# EasyEDA Pro project ProProject_高通AI开发板9.7.epro, board PCB3
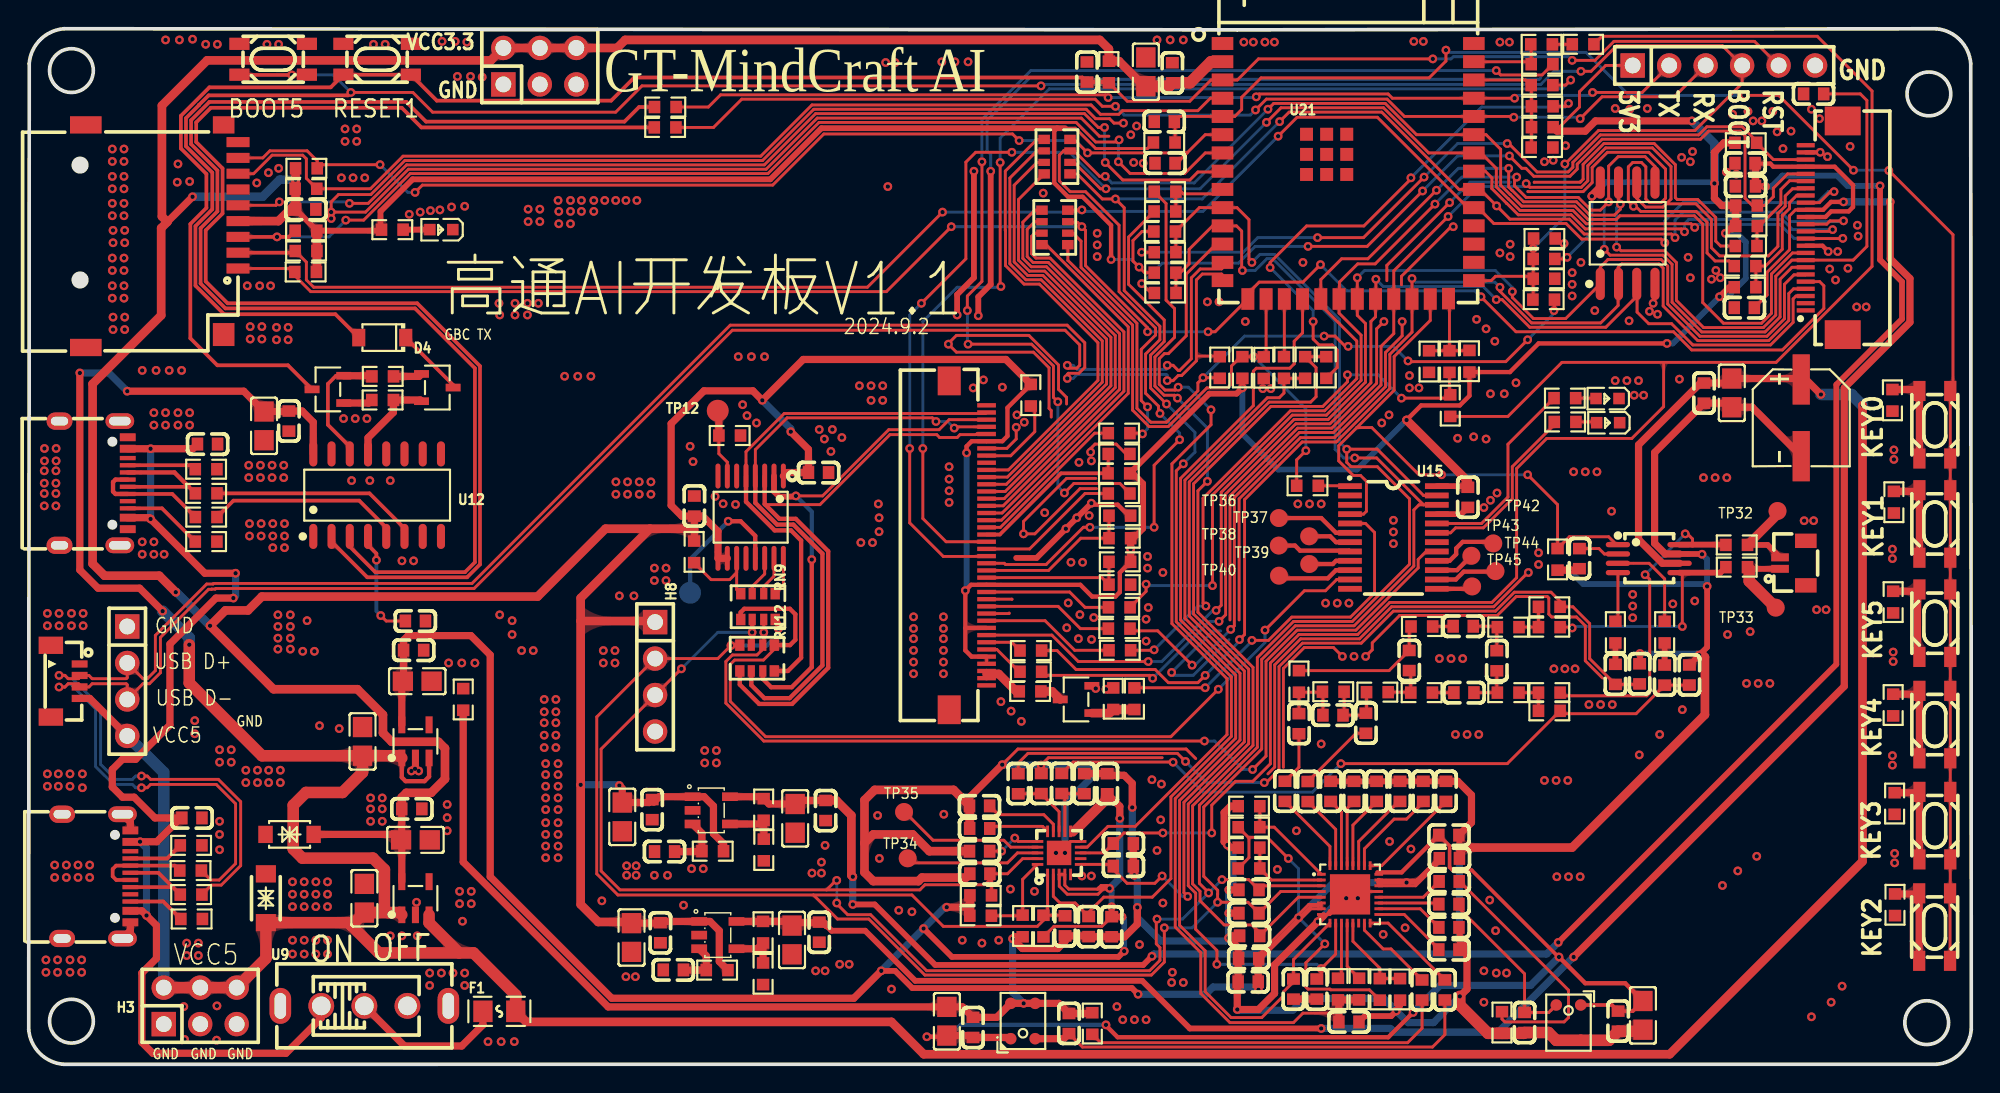
[diagram p5: board, top side]
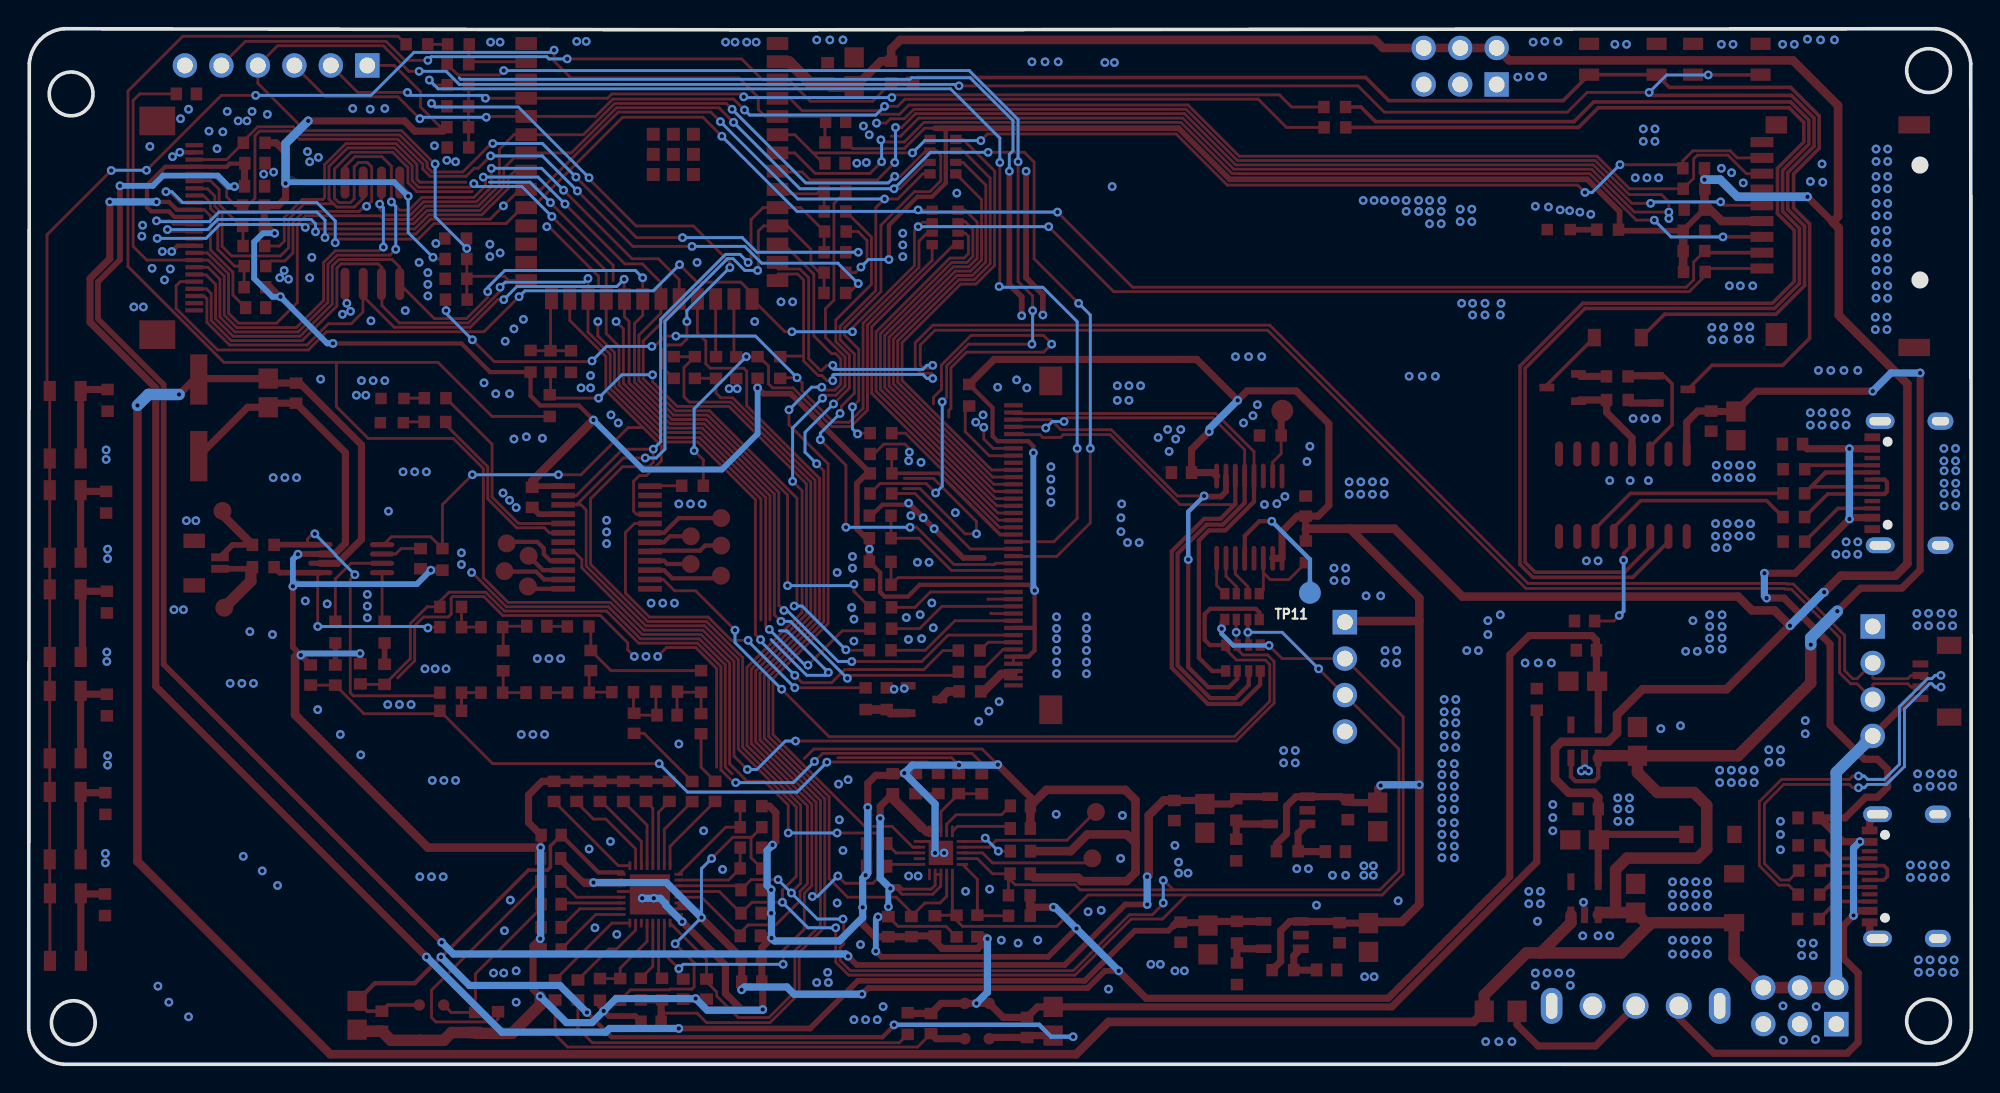
[diagram p6: board, bottom side, seen from below]

Outline 135.26 x 72.11 mm; copper layers: Top Layer, Bottom Layer. Coordinates in mm from the lower left corner of the outline.
Outline path: circle c2.98,69.19 r1.52 ; circle c2.98,3 r1.52 ; circle c132.16,2.9 r1.52 ; circle c132.31,67.57 r1.52 ; 0.04,69.69 0,2.42 arc(0.76,0.77) 2.42,0 132.84,0 arc(134.5,0.77) 135.26,2.42 135.22,69.69 arc(134.47,71.33) 132.83,72.1 84.15,72.03 2.45,72.11 arc(0.8,71.34) 0.04,69.69
Stack: Top Layer 0.035mm - / Dielectric1 1.51mm FR4 er 4.5 / Bottom Layer 0.035mm -

## Design rules (mm)
net ESP_USB_DP: DP1
net ESP_USB_DM: DP1
template: 自定义配置
spacing copperThickness1oz (default): track to track 0.102, other pairs 0.152 to 0.3
spacing copperThickness2oz: track to track 0.203, other pairs 0.152 to 0.3
track width copperThickness1oz (default): min 0.127, default 0.254, max 2.54
track width copperThickness2oz: min 0.203, default 0.254, max 2.54
differential pair differentialPair (default): width min 0.127, default 0.254, max 2.54; gap min 0.152, default 0.152
via viaSize (default): diameter min 0.5, default 0.61, max 10; hole min 0.3, default 0.305, max 6.3

## Placement (name value [footprint] x y rotation side)
BOOT5  TS-1145A-B-A  [SW-SMD_4P-L4.2-W3.2-P2.15-LS5.2]  17.02 69.98 270 top
C1  100nF  [C0603]  73.69 69.09 90 top
C4  100nF  [C0603]  19.29 59.53 180 top
C10  10uF  [C0805]  23.37 11.56 270 top
C11  10uF  [C0805]  26.93 15.62 180 top
C12  100nF  [C0603]  26.67 17.78 180 top
C13  10uF  [C0805]  23.24 22.48 270 top
C14  10uF  [C0805]  27.05 26.67 180 top
C15  100nF  [C0603]  26.8 28.83 180 top
C16  100nF  [C0603]  11.36 17.15 180 top
C34  470nF  [C0603]  99.93 25.88 180 top
C35  100nF  [C0603]  26.93 30.86 0 top
C36  10uF  [C0805]  16.39 44.45 270 top
C37  100nF  [C0603]  18.12 44.78 270 top
C38  100nF  [C0603]  12.45 43.18 180 top
C39  470nF  [C0603]  99.88 30.5 180 top
C40  220nF  [C0603]  88.45 23.72 270 top
C41  100nF  [C0603]  100.21 39.48 270 top
C69  100nF  [C0603]  54.99 41.2 180 top
C70  100nF  [C0603]  46.35 38.87 270 top
C73  22uF  [C0805]  77.79 69.11 90 top
C74  100nF  [C0603]  79.63 69.04 90 top
C75  100nF  [C0603]  79.12 62.74 0 top
C76  100nF  [C0603]  79.07 65.64 0 top
C78  10uF  [C0805]  41.33 17.22 90 top
C79  100nF  [C0603]  43.41 17.73 90 top
C80  100nF  [C0603]  44.28 14.81 0 top
C81  10uF  [C0805]  53.37 17.12 90 top
C82  100nF  [C0603]  55.49 17.67 90 top
C83  10uF  [C0805]  41.97 8.83 90 top
C84  100nF  [C0603]  43.98 9.16 90 top
C85  100nF  [C0603]  44.89 6.57 0 top
C86  10uF  [C0805]  53.15 8.66 90 top
C87  100nF  [C0603]  55.05 9.2 90 top
C88  100nF  [C0603]  119.51 62.74 180 top
C89  100nF  [C0603]  119.46 52.68 180 top
C90  100nF  [C0603]  119.54 61.14 180 top
C91  22pF/NC  [C0603]  124.28 67.57 0 top
C92  22pF  [C0603]  73.8 9.59 90 top
C93  22pF  [C0603]  72.16 9.64 90 top
C94  100nF  [C0603]  75.41 9.58 90 top
C95  22pF  [C0603]  76.22 13.8 180 top
C96  22pF  [C0603]  76.22 15.37 180 top
C97  1uF  [C0603]  75.1 19.54 270 top
C98  1uF  [C0603]  68.9 19.54 270 top
C99  1uF  [C0603]  71.93 19.55 270 top
C100  22pF  [C0603]  70.51 19.55 270 top
C101  22pF  [C0603]  73.5 19.54 270 top
C102  1uF  [C0603]  66.21 17.99 0 top
C103  1uF  [C0603]  66.22 16.42 0 top
C104  1uF  [C0603]  66.21 14.84 0 top
C105  22pF  [C0603]  66.23 13.27 0 top
C106  1uF  [C0603]  84.94 7.37 180 top
C107  100nF  [C0603]  84.91 5.74 0 top
C108  22pF  [C0603]  84.97 12.14 0 top
C109  22pF  [C0603]  84.97 10.52 0 top
C110  22pF  [C0603]  85.02 8.94 0 top
C111  22pF  [C0603]  88.06 5.24 90 top
C112  22pF  [C0603]  89.69 5.24 90 top
C113  22pF  [C0603]  91.93 2.95 180 top
C114  1uF  [C0603]  97.02 5.17 270 top
C115  1uF  [C0603]  98.61 5.18 270 top
C116  1uF  [C0603]  98.89 9.53 180 top
C117  1uF  [C0603]  98.89 7.98 180 top
C118  1uF  [C0603]  98.91 12.73 180 top
C119  1uF  [C0603]  98.89 11.15 180 top
C120  1uF  [C0603]  98.92 14.33 180 top
C121  1uF  [C0603]  98.89 15.95 180 top
C122  1uF  [C0603]  98.68 19 270 top
C123  1uF  [C0603]  97.11 19 270 top
C124  1uF  [C0603]  95.48 19 270 top
C125  1uF  [C0603]  93.86 19 270 top
C126  1uF  [C0603]  92.28 19 270 top
C127  1uF  [C0603]  90.66 19 270 top
C128  1uF  [C0603]  89.07 18.99 270 top
C129  1uF  [C0603]  87.47 19 270 top
C130  1uF  [C0603]  107.98 35.21 270 top
C131  1uF  [C0603]  116.65 46.73 270 top
C132  10uF  [C0805]  118.59 46.75 90 top
C133  220uF  [CAP-SMD_BD6.3-L6.6-W6.6-FD]  123.42 45.01 270 top
C134  1uF  [C0603]  65.75 2.57 90 top
C135  10uF  [C0805]  63.93 3 270 top
C136  22pF  [C0603]  72.43 2.84 270 top
C137  1uF  [C0603]  110.67 3 270 top
C138  10uF  [C0805]  112.4 3.41 90 top
C139  22pF  [C0603]  104.16 2.91 90 top
C140  22pF  [C0603]  115.63 27.11 270 top
C141  100nF  [C0603]  113.91 27.1 270 top
C142  22pF  [C0603]  112.17 27.19 270 top
C143  100nF  [C0603]  110.48 27.15 270 top
C144  220nF  [C0603]  93.11 23.75 270 top
C145  10nF  [C0603]  102.23 28.1 270 top
C146  2.2nF  [C0603]  96.12 28.11 270 top
C147  100pF  [C0603]  90.82 24.31 0 top
CARD1  TF PUSH  [TF-SMD_TF-PUSH]  9.27 57.66 270 top
CN5  0.8-2AB  [CONN-SMD_2P-P0.80_HCTL_HC-0.8-2PWT]  122.84 34.9 90 top
CN6  M0800RS-04-GN  [CONN-SMD_M0800RS-04-GN]  2.54 26.67 270 top
D2  SMFJ5.0CA  [SOD-123FL_L2.8-W1.8-LS3.7-BI]  16.51 11.56 270 top
D3  SMFJ3.3CA  [SOD-123_L2.7-W1.6-LS3.7-BI]  18.16 16.01 0 top
D4  1N5819HW-7-F  [SOD-123_L2.7-W1.6-LS3.7-RD]  24.62 50.6 180 top
F1  BSMD0805-100-6V  [F0805]  32.77 3.69 0 top
FPC5  AFC01-S40FCA-00  [FPC-SMD_P0.50-40P_FGS-XJ-H2.0]  65.4 36.14 90 top
FPC6  FPC-05F-24PH20  [FPC-SMD_24P-P0.50_FPC-05F-24PH20]  125.02 58.25 90 top
H2  PZ254V-12-6P  [HDR-TH_6P-P2.54-V-M-R2-C3-S2.54]  35.59 69.5 0 top
H3  PZ254V-12-6P  [HDR-TH_6P-P2.54-V-M-R2-C3-S2.54]  11.94 4.07 0 top
H5  PZ254V-11-04P  [HDR-TH_4P-P2.54-V-M]  6.86 26.67 270 top
H7  PZ254V-11-06P  [HDR-TH_6P-P2.54-V-M]  118.04 69.55 0 top
H8  PZ254V-11-04P  [HDR-TH_4P-P2.54-V-M]  43.62 26.98 270 top
KEY0  TS-1145A-B-A  [SW-SMD_4P-L4.2-W3.2-P2.15-LS5.2]  132.72 44.53 180 top
KEY1  TS-1145A-B-A  [SW-SMD_4P-L4.2-W3.2-P2.15-LS5.2]  132.72 37.62 180 top
KEY2  TS-1145A-B-A  [SW-SMD_4P-L4.2-W3.2-P2.15-LS5.2]  132.71 9.55 180 top
KEY3  TS-1145A-B-A  [SW-SMD_4P-L4.2-W3.2-P2.15-LS5.2]  132.72 16.62 180 top
KEY4  TS-1145A-B-A  [SW-SMD_4P-L4.2-W3.2-P2.15-LS5.2]  132.72 23.65 180 top
KEY5  TS-1145A-B-A  [SW-SMD_4P-L4.2-W3.2-P2.15-LS5.2]  132.72 30.71 180 top
LED2  KT-0603R  [LED0603-RD]  28.73 58.12 180 top
LED3  KT-0603R  [LED0603-RD]  109.98 44.67 180 top
LED4  KT-0603R  [LED0603-RD]  109.93 46.36 180 top
Q2  S8050 J3Y  [SOT-23-3_L3.0-W1.7-P0.95-LS2.9-BR]  28.45 47.12 180 top
Q3  S8050 J3Y  [SOT-23-3_L3.0-W1.7-P0.95-LS2.9-BR]  20.83 46.99 0 top
Q4  S8050 J3Y  [SOT-23-3_L3.0-W1.7-P0.95-LS2.9-BR]  72.93 25.4 0 top
R1  10kΩ  [R0603]  75.21 69.09 90 top
R3  510Ω  [R0603]  25.32 58.11 0 top
R7  47kΩ  [R0603]  19.31 56.63 180 top
R8  47kΩ  [R0603]  19.31 58.04 180 top
R9  47kΩ  [R0603]  19.31 60.96 0 top
R11  10kΩ/NC  [R0603]  48.81 43.78 0 top
R13  100kΩ/NC  [R0603]  46.33 35.68 270 top
R26  10kΩ  [R0603]  24.65 47.9 0 top
R27  10kΩ  [R0603]  24.64 46.25 180 top
R28  4.7kΩ  [R0603]  12.35 41.43 180 top
R29  4.7kΩ  [R0603]  12.35 36.39 180 top
R30  22Ω  [R0603]  12.36 39.75 180 top
R31  22Ω  [R0603]  12.36 38.1 180 top
R41  4.7kΩ  [R0603]  11.31 15.24 180 top
R42  4.7kΩ  [R0603]  11.34 10.12 180 top
R43  22Ω  [R0603]  11.27 13.49 180 top
R44  22Ω  [R0603]  11.31 11.81 180 top
R53  33Ω  [R0603]  75.93 39.74 180 top
R54  33Ω  [R0603]  75.92 43.95 180 top
R55  33Ω  [R0603]  75.93 30.33 180 top
R56  33Ω  [R0603]  75.94 31.82 180 top
R57  33Ω  [R0603]  69.78 28.81 180 top
R58  33Ω  [R0603]  75.97 28.83 180 top
R60  33Ω  [R0603]  69.78 27.33 180 top
R61  0Ω  [R0603]  75.91 41.14 180 top
R62  0Ω/NC  [R0603]  75.92 42.5 180 top
R63  1Ω  [R0603]  69.73 25.96 180 top
R64  0Ω  [R0603]  69.78 46.59 270 top
R65  0Ω  [R0603]  75.97 38.2 0 top
R66  0Ω/NC  [R0603]  75.97 36.63 0 top
R67  0Ω/NC  [R0603]  75.97 34.99 0 top
R68  0Ω  [R0603]  75.97 33.39 0 top
R69  1kΩ  [R0603]  76.99 25.45 270 top
R70  4.7kΩ  [R0603]  75.52 25.45 270 top
R73  0Ω  [R0603]  89.04 40.28 0 top
R77  47kΩ  [R0603]  19.28 55.17 180 top
R78  47kΩ  [R0603]  19.33 62.39 0 top
R80  0Ω  [R0603]  79.12 59.38 0 top
R81  0Ω  [R0603]  88.88 48.52 270 top
R82  0Ω  [R0603]  98.98 45.86 90 top
R83  0Ω  [R0603]  79.12 60.76 0 top
R84  0Ω  [R0603]  87.4 48.52 90 top
R85  0Ω  [R0603]  98.93 48.93 90 top
R87  0Ω  [R0603]  90.35 48.52 270 top
R88  0Ω  [R0603]  108.23 71.02 180 top
R89  0Ω  [R0603]  79.12 56.54 0 top
R90  0Ω  [R0603]  79.13 53.71 0 top
R91  0Ω/NC  [R0603]  82.93 48.52 90 top
R93  0Ω/NC  [R0603]  105.39 66.7 180 top
R94  0Ω  [R0603]  105.37 68.18 180 top
R95  0Ω/NC  [R0603]  105.34 71.02 180 top
R96  0Ω  [R0603]  105.37 69.64 180 top
R97  10kΩ/NC  [R0603]  84.51 48.52 270 top
R98  10kΩ  [R0603]  79.07 64.18 180 top
R99  10kΩ/NC  [R0603]  100.32 48.95 270 top
R100  10kΩ/NC  [R0603]  105.39 65.25 0 top
R101  10kΩ/NC  [R0603]  105.51 56.08 0 top
R102  10kΩ/NC  [R0603]  86 48.5 90 top
R103  10kΩ/NC  [R0603]  97.5 48.93 90 top
R104  10kΩ/NC  [R0603]  105.37 63.84 180 top
R105  10kΩ/NC  [R0603]  105.54 57.5 180 top
R106  0Ω/NC  [R0603]  105.49 53.24 180 top
R107  0Ω  [R0603]  105.51 54.7 180 top
R108  3.3kΩ  [R0603]  79.1 57.99 180 top
R109  3.3kΩ  [R0603]  79.12 55.12 180 top
R115  10kΩ  [R0603]  47.63 14.84 0 top
R116  150kΩ  [R0603]  51.18 17.74 90 top
R117  120kΩ  [R0603]  51.18 14.92 90 top
R118  10kΩ  [R0603]  47.93 6.56 0 top
R120  120kΩ  [R0603]  51.13 6.3 90 top
R121  24kΩ  [R0603]  51.13 9.2 90 top
R122  10kΩ/NC  [R0603]  119.56 64.16 180 top
R123  10kΩ/NC  [R0603]  119.61 59.8 180 top
R124  10kΩ/NC  [R0603]  119.51 54.11 180 top
R125  10kΩ  [R0603]  119.61 58.37 180 top
R126  10kΩ/NC  [R0603]  119.59 56.98 0 top
R127  10kΩ  [R0603]  119.51 55.58 0 top
R129  5.1kΩ  [R0603]  106.98 44.73 0 top
R132  5.1kΩ  [R0603]  106.96 46.38 0 top
R134  2kΩ/NC  [R0603]  70.66 9.62 270 top
R135  2kΩ/NC  [R0603]  66.29 11.76 180 top
R136  10kΩ  [R0603]  69.21 9.63 270 top
R137  10kΩ/NC  [R0603]  66.28 10.34 0 top
R138  10kΩ/NC  [R0603]  84.97 16.51 0 top
R139  10kΩ  [R0603]  84.97 17.97 0 top
R140  10kΩ/NC  [R0603]  84.97 13.64 0 top
R141  10kΩ  [R0603]  84.97 15.09 0 top
R142  51Ω  [R0603]  91.16 5.24 90 top
R143  0Ω/NC  [R0603]  92.64 5.24 90 top
R144  10kΩ/NC  [R0603]  94.08 5.21 90 top
R145  10kΩ/NC  [R0603]  95.49 5.21 90 top
R146  10kΩ  [R0603]  106.45 35.16 90 top
R147  0Ω  [R0603]  74.06 2.84 270 top
R148  0Ω  [R0603]  102.59 2.91 90 top
R149  0Ω  [R0603]  118.93 36.16 0 top
R150  0Ω  [R0603]  118.93 34.62 0 top
R151  150kΩ  [R0603]  113.91 30.09 90 top
R152  150kΩ  [R0603]  110.48 30.09 90 top
R153  2.2kΩ  [R0603]  103.02 25.88 180 top
R154  2.2kΩ  [R0603]  103.02 30.44 180 top
R155  20kΩ  [R0603]  93.91 25.91 180 top
R156  20kΩ  [R0603]  88.45 26.66 270 top
R157  10kΩ  [R0603]  96.99 25.88 0 top
R158  10kΩ  [R0603]  97.01 30.48 0 top
R159  4.3kΩ  [R0603]  90.84 25.94 0 top
R160  0Ω  [R0603]  105.88 24.61 180 top
R161  0Ω  [R0603]  105.88 31.85 180 top
R162  0Ω/NC  [R0603]  105.88 25.88 180 top
R163  0Ω/NC  [R0603]  105.88 30.44 180 top
R164  27kΩ  [R0603]  129.77 46.23 90 top
R165  10kΩ  [R0603]  129.95 11.11 90 top
R166  15kΩ  [R0603]  129.87 39.14 90 top
R167  5.1kΩ  [R0603]  129.92 18.16 90 top
R168  3.3kΩ  [R0603]  129.82 25.01 90 top
R169  1.3kΩ  [R0603]  129.82 32.18 90 top
R170  0Ω  [R0603]  30.25 25.4 90 top
R171  0Ω  [R0603]  44.31 65.23 0 top
R172  0Ω  [R0603]  44.33 66.65 0 top
RESET1  TS-1145A-B-A  [SW-SMD_4P-L4.2-W3.2-P2.15-LS5.2]  24.26 69.98 270 top
RN9  33Ω  [RES-ARRAY-SMD_0603-8P-L3.2-W1.6-BL]  50.78 31.87 180 top
RN10  33Ω  [RES-ARRAY-SMD_0603-8P-L3.2-W1.6-BL]  71.61 63.2 90 top
RN11  33Ω  [RES-ARRAY-SMD_0603-8P-L3.2-W1.6-BL]  71.45 58.27 90 top
RN12  33Ω  [RES-ARRAY-SMD_0603-8P-L3.2-W1.6-BL]  50.71 28.29 180 top
TP11  -  [TP]  46.05 32.83 180 bottom
TP12  -  [TP]  47.98 45.51 180 top
TP32  -  [测试点]  121.77 38.53 270 top
TP33  -  [测试点]  121.64 31.8 270 top
TP34  -  [测试点]  61.2 14.34 0 top
TP35  -  [测试点]  60.95 17.57 0 top
TP36  -  [测试点]  87.05 38.03 270 top
TP37  -  [测试点]  89.16 36.76 270 top
TP38  -  [测试点]  87.04 36.12 270 top
TP39  -  [测试点]  89.16 34.83 270 top
TP40  -  [测试点]  87.06 34.02 270 top
TP42  -  [测试点]  101.98 36.27 180 top
TP43  -  [测试点]  100.46 35.41 90 top
TP44  -  [测试点]  102.13 34.34 90 top
TP45  -  [测试点]  100.51 33.27 90 top
U7  RT9013-33GB  [SOT-23-5_L3.0-W1.7-P0.95-LS2.8-BL]  26.93 11.56 0 top
U8  RT9013-33GB  [SOT-23-5_L3.0-W1.7-P0.95-LS2.8-BL]  26.93 22.48 0 top
U9  SS-12F44-G5  [SW-TH_SS-12F44-G5_C2998807]  23.37 4.07 0 top
U12  CH340C  [SOP-16_L10.0-W3.9-P1.27-LS6.0-BL]  24.26 39.63 0 top
U15  XL9555  [TSSOP-24_L7.8-W4.4-P0.65-LS6.4-BL]  95.02 36.68 270 top
U18  -  [TSSOP-16_L5.0-W4.4-P0.65-LS6.4-BL]  50.27 38.09 180 top
U21  ESP32-S3-WROOM-1-N16R8  [WIRELM-SMD_ESP32-S3-WROOM-1]  91.88 62.18 0 top
U23  GT5GL64/GT5GL128  [SOIC-8_L5.3-W5.3-P1.27-LS8.0-BL]  111.33 57.86 0 top
U24  ME6221CM5G  [SOT-23-5_L3.0-W1.7-P0.95-LS2.8-BR]  47.53 17.68 180 top
U25  ME6221CM5G  [SOT-23-5_L3.0-W1.7-P0.95-LS2.8-BR]  47.98 9 180 top
U26  ES8311  [WQFN-20_L3.0-W3.0-P0.40-BL-EP1.7]  71.75 14.72 0 top
U29  ES7210  [QFN-32_L4.0-W4.0-P0.40-BL-EP2.7]  92 11.83 270 top
U30  NS4150B  [MSOP-8_L3.0-W3.0-P0.65-LS5.0-BL]  112.8 35.21 270 top
U31  LMA3729T381-OY1S  [MIC-SMD_4P-L3.8-W3.0-P2.46-S1.70-TR-1]  69.23 3.01 180 top
U32  LMA3729T381-OY1S  [MIC-SMD_4P-L3.8-W3.0-P2.46-S1.70-TR-1]  107.22 2.9 0 top
USB2  TYPE-C 16PIN 2MD(073)  [USB-C-SMD_TYPE-C-6PIN-2MD-073]  4.52 40.46 270 top
USB3  TYPE-C 16PIN 2MD(073)  [USB-C-SMD_TYPE-C-6PIN-2MD-073]  4.7 13.08 270 top

## Footprints (pads in the part's own frame, mm; a bottom-side part is the same pattern mirrored in y, then rotated)
C0603
  rect 0.8x0.9 smd: 1(-0.7,0) 2(0.7,0)
C0805
  rect 1.41x1.35 smd: 1(-1,0) 2(1,0)
CAP-SMD_BD6.3-L6.6-W6.6-FD
  rect 3.5x1.2 smd: 1(-2.67,0) 2(2.67,0)
CONN-SMD_2P-P0.80_HCTL_HC-0.8-2PWT
  rect 0.55x1.23 smd: 1(-0.4,0.898) 2(0.4,0.898)
  rect 1x1.5 smd: 3(1.55,-0.898) 4(-1.55,-0.898)
CONN-SMD_M0800RS-04-GN
  rect 0.5x1.1 smd: 1(-1.2,1) 2(-0.4,1) 3(0.4,1) 4(1.2,1)
  rect 1.2x1.7 smd: 5(2.5,-1) 6(-2.5,-1)
F0805
  rect 1.335x1.5 smd: 1(-1.143,0) 2(1.143,0)
FPC-SMD_24P-P0.50_FPC-05F-24PH20
  rect 0.3x1.25 smd: 1(5.75,1.288) 2(5.25,1.288) 3(4.75,1.288) 4(4.25,1.288) 5(3.75,1.288) 6(3.25,1.288) 7(2.75,1.288) 8(2.25,1.288) 9(1.75,1.288) 10(1.25,1.288) 11(0.75,1.288) 12(0.25,1.288) 13(-0.25,1.288) 14(-0.75,1.288) 15(-1.25,1.288) 16(-1.75,1.288) 17(-2.25,1.288) 18(-2.75,1.288) 19(-3.25,1.288) 20(-3.75,1.288) 21(-4.25,1.288) 22(-4.75,1.288) 23(-5.25,1.288) 24(-5.75,1.288)
  rect 2x2.5 smd: 25(7.44,-1.288) 26(-7.44,-1.288)
FPC-SMD_P0.50-40P_FGS-XJ-H2.0
  rect 0.3x1.3 smd: 1(9.75,-1.3) 2(9.25,-1.3) 3(8.75,-1.3) 4(8.25,-1.3) 5(7.75,-1.3) 6(7.25,-1.3) 7(6.75,-1.3) 8(6.25,-1.3) 9(5.75,-1.3) 10(5.25,-1.3) 11(4.75,-1.3) 12(4.25,-1.3) 13(3.75,-1.3) 14(3.25,-1.3) 15(2.75,-1.3) 16(2.25,-1.3) 17(1.75,-1.3) 18(1.25,-1.3) 19(0.75,-1.3) 20(0.25,-1.3) 21(-0.25,-1.3) 22(-0.75,-1.3) 23(-1.25,-1.3) 24(-1.75,-1.3) 25(-2.25,-1.3) 26(-2.75,-1.3) 27(-3.25,-1.3) 28(-3.75,-1.3) 29(-4.25,-1.3) 30(-4.75,-1.3) 31(-5.25,-1.3) 32(-5.75,-1.3) 33(-6.25,-1.3) 34(-6.75,-1.3) 35(-7.25,-1.3) 36(-7.75,-1.3) 37(-8.25,-1.3) 38(-8.75,-1.3) 39(-9.25,-1.3) 40(-9.75,-1.3)
  rect 2x1.6 smd: 41(-11.45,1.3) 42(11.45,1.3)
HDR-TH_4P-P2.54-V-M
  rect 1.7x1.7 hole 1.1: 1(-3.81,0)
  round 1.7 hole 1.1: 2(-1.27,0) 3(1.27,0) 4(3.81,0)
HDR-TH_6P-P2.54-V-M
  rect 1.7x1.7 hole 1.1: 1(-6.35,0)
  round 1.7 hole 1.1: 2(-3.81,0) 3(-1.27,0) 4(1.27,0) 5(3.81,0) 6(6.35,0)
HDR-TH_6P-P2.54-V-M-R2-C3-S2.54
  rect 1.7x1.7 hole 1.1: 1(-2.54,-1.27)
  round 1.7 hole 1.1: 2(-2.54,1.27) 3(0,-1.27) 4(0,1.27) 5(2.54,-1.27) 6(2.54,1.27)
LED0603-RD
  rect 0.8x0.8 smd: 1(-0.799,0) 2(0.799,0)
MIC-SMD_4P-L3.8-W3.0-P2.46-S1.70-TR-1
  round 0.8 smd: 1(0.85,1.23) 2(0.85,-1.23) 3(-0.85,-1.23) 4(-0.85,1.23)
MSOP-8_L3.0-W3.0-P0.65-LS5.0-BL
  oval 0.364x1.692 smd: 1(-0.975,-2.146) 2(-0.325,-2.146) 3(0.325,-2.146) 4(0.975,-2.146) 5(0.975,2.146) 6(0.325,2.146) 7(-0.325,2.146) 8(-0.975,2.146)
QFN-32_L4.0-W4.0-P0.40-BL-EP2.7
  rect 0.2x0.6 smd: 1(-1.4,-2) 2(-1,-2) 3(-0.6,-2) 4(-0.2,-2) 5(0.2,-2) 6(0.6,-2) 7(1,-2) 8(1.4,-2) 17(1.4,2) 18(1,2) 19(0.6,2) 20(0.2,2) 21(-0.2,2) 22(-0.6,2) 23(-1,2) 24(-1.4,2)
  rect 0.6x0.2 smd: 9(2,-1.4) 10(2,-1) 11(2,-0.6) 12(2,-0.2) 13(2,0.2) 14(2,0.6) 15(2,1) 16(2,1.4) 25(-2,1.4) 26(-2,1) 27(-2,0.6) 28(-2,0.2) 29(-2,-0.2) 30(-2,-0.6) 31(-2,-1) 32(-2,-1.4)
  rect 2.8x2.8 smd: 33(0,0)
R0603
  rect 0.806x0.864 smd: 1(-0.753,0) 2(0.753,0)
RES-ARRAY-SMD_0603-8P-L3.2-W1.6-BL
  rect 0.65x0.8 smd: 1(-1.2,-0.9) 4(1.2,-0.9) 5(1.2,0.9) 8(-1.2,0.9)
  rect 0.5x0.8 smd: 2(-0.4,-0.9) 3(0.4,-0.9) 6(0.4,0.9) 7(-0.4,0.9)
SOD-123_L2.7-W1.6-LS3.7-BI
  rect 1x1.2 smd: 1(-1.675,0) 2(1.675,0)
SOD-123_L2.7-W1.6-LS3.7-RD
  rect 0.91x1.22 smd: 1(-1.635,0) 2(1.635,0)
SOD-123FL_L2.8-W1.8-LS3.7-BI
  rect 1.2x1.4 smd: 1(-1.7,0) 2(1.7,0)
SOIC-8_L5.3-W5.3-P1.27-LS8.0-BL
  oval 0.63x2.25 smd: 1(-1.905,-3.53) 2(-0.635,-3.53) 3(0.635,-3.53) 4(1.905,-3.53) 5(1.905,3.53) 6(0.635,3.53) 7(-0.635,3.53) 8(-1.905,3.53)
SOP-16_L10.0-W3.9-P1.27-LS6.0-BL
  oval 0.56x1.745 smd: 1(-4.445,-2.873) 2(-3.175,-2.873) 3(-1.905,-2.873) 4(-0.635,-2.873) 5(0.635,-2.873) 6(1.905,-2.873) 7(3.175,-2.873) 8(4.445,-2.873) 9(4.445,2.873) 10(3.175,2.873) 11(1.905,2.873) 12(0.635,2.873) 13(-0.635,2.873) 14(-1.905,2.873) 15(-3.175,2.873) 16(-4.445,2.873)
SOT-23-3_L3.0-W1.7-P0.95-LS2.9-BR
  rect 1.038x0.532 smd: 1(1.101,-0.95) 2(1.101,0.95) 3(-1.101,0)
SOT-23-5_L3.0-W1.7-P0.95-LS2.8-BL
  rect 0.49x1.157 smd: 1(-0.95,-1.153) 2(0,-1.153) 3(0.95,-1.153)
  rect 0.49x1.175 smd: 4(0.95,1.153) 5(-0.95,1.153)
SOT-23-5_L3.0-W1.7-P0.95-LS2.8-BR
  rect 1.1x0.6 smd: 1(1.3,-0.95) 2(1.3,0) 3(1.3,0.95) 4(-1.3,0.95) 5(-1.3,-0.95)
SW-SMD_4P-L4.2-W3.2-P2.15-LS5.2
  rect 0.85x1.4 smd: 1(1.075,2.35) 2(1.075,-2.35) 3(-1.075,2.35) 4(-1.075,-2.35)
SW-TH_SS-12F44-G5_C2998807
  round 1.8 hole 1.3: 1(-3,0) 2(0,0) 3(3,0)
  oval 1.5x2.5 hole 0.8x1.8: 4(5.85,0) 5(-5.85,0)
TF-SMD_TF-PUSH
  rect 0.7x1.6 smd: 1(2.25,5.3) 2(1.15,5.3) 3(0.05,5.3) 4(-1.05,5.3) 5(-2.15,5.3) 6(-3.25,5.3) 7(-4.35,5.3) 8(-5.45,5.3) CD(-6.55,5.3)
  rect 1.2x1.5 smd: 10(-7.75,4.3)
  rect 1.2x2.2 smd: 11(-7.75,-5.3) 12(7.75,-5.3)
  rect 1.6x1.5 smd: 13(6.85,4.3)
TP
  round 1.524 smd: 1(0,0)
TSSOP-16_L5.0-W4.4-P0.65-LS6.4-BL
  oval 0.343x1.732 smd: 1(-2.276,-2.865) 2(-1.625,-2.865) 3(-0.976,-2.865) 4(-0.325,-2.865) 5(0.325,-2.865) 6(0.976,-2.865) 7(1.625,-2.865) 8(2.276,-2.865) 9(2.276,2.865) 10(1.625,2.865) 11(0.976,2.865) 12(0.325,2.865) 13(-0.325,2.865) 14(-0.976,2.865) 15(-1.625,2.865) 16(-2.276,2.865)
TSSOP-24_L7.8-W4.4-P0.65-LS6.4-BL
  rect 0.4x1.65 smd: 1(-3.575,-3.022) 2(-2.925,-3.022) 3(-2.275,-3.022) 4(-1.625,-3.022) 5(-0.975,-3.022) 6(-0.325,-3.022) 7(0.325,-3.022) 8(0.975,-3.022) 9(1.625,-3.022) 10(2.275,-3.022) 11(2.925,-3.022) 12(3.575,-3.022) 13(3.575,3.022) 14(2.925,3.022) 15(2.275,3.022) 16(1.625,3.022) 17(0.975,3.022) 18(0.325,3.022) 19(-0.325,3.022) 20(-0.975,3.022) 21(-1.625,3.022) 22(-2.275,3.022) 23(-2.925,3.022) 24(-3.575,3.022)
USB-C-SMD_TYPE-C-6PIN-2MD-073
  rect 0.55x1.1 smd: 1(-3.2,2.375) 2(-2.4,2.375) 11(2.4,2.375) 12(3.2,2.375)
  rect 0.3x1.1 smd: 3(-1.75,2.375) 4(-1.25,2.375) 5(-0.75,2.375) 6(-0.25,2.375) 7(0.25,2.375) 8(0.75,2.375) 9(1.25,2.375) 10(1.75,2.375)
  oval 1.1x2 hole 0.6x1.5: 13(-4.325,1.825) 14(4.325,1.825)
  oval 1.2x1.8 hole 0.6x1.2: 13(-4.325,-2.375) 14(4.325,-2.375)
WIRELM-SMD_ESP32-S3-WROOM-1
  rect 1.5x0.9 smd: 1(-8.75,8.895) 2(-8.75,7.625) 3(-8.75,6.355) 4(-8.75,5.085) 5(-8.75,3.815) 6(-8.75,2.545) 7(-8.75,1.275) 8(-8.75,0.005) 9(-8.75,-1.265) 10(-8.75,-2.535) 11(-8.75,-3.805) 12(-8.75,-5.075) 13(-8.75,-6.345) 14(-8.75,-7.615) 27(8.75,-7.615) 28(8.75,-6.345) 29(8.75,-5.075) 30(8.75,-3.805) 31(8.75,-2.535) 32(8.75,-1.265) 33(8.75,0.005) 34(8.75,1.275) 35(8.75,2.545) 36(8.75,3.815) 37(8.75,5.085) 38(8.75,6.355) 39(8.75,7.625) 40(8.75,8.895)
  rect 0.9x1.5 smd: 15(-6.985,-8.895) 16(-5.715,-8.895) 17(-4.445,-8.895) 18(-3.175,-8.895) 19(-1.905,-8.895) 20(-0.635,-8.895) 21(0.635,-8.895) 22(1.905,-8.895) 23(3.175,-8.895) 24(4.445,-8.895) 25(5.715,-8.895) 26(6.985,-8.865)
  rect 0.9x0.9 smd: 41(-2.9,2.575) 41(-2.9,1.175) 41(-2.9,-0.225) 41(-1.5,2.575) 41(-1.5,1.175) 41(-1.5,-0.225) 41(-0.1,2.575) 41(-0.1,1.175) 41(-0.1,-0.225)
WQFN-20_L3.0-W3.0-P0.40-BL-EP1.7
  rect 0.2x0.8 smd: 1(-0.8,-1.5) 2(-0.4,-1.5) 3(0,-1.5) 4(0.4,-1.5) 5(0.8,-1.5) 11(0.8,1.5) 12(0.4,1.5) 13(0,1.5) 14(-0.4,1.5) 15(-0.8,1.5)
  rect 0.8x0.2 smd: 6(1.5,-0.8) 7(1.5,-0.4) 8(1.5,0) 9(1.5,0.4) 10(1.5,0.799) 16(-1.5,0.8) 17(-1.5,0.4) 18(-1.5,0) 19(-1.5,-0.4) 20(-1.5,-0.8)
  rect 1.7x1.7 smd: 21(0,0)
测试点
  round 1.25 smd: 1(0,0)

## Nets
As in the schematic.

Pads without a net: FPC5 9; FPC6 1 23 24; U7 4; U8 4; U9 3; U12 7 8 9 10 11 12 15; U21 28 29 30; U29 14; USB2 3 9; USB3 3 9

## Via types
v1: diameter 0.61, hole 0.305, Top Layer to Bottom Layer, 937 vias

## Routing (per net, layer and track width the routed paths; a pad name or vN(x,y) marks a point on that pad's centre or on a via; arc(x,y) is an arc through that point)
AGND: length 347.3
  Top Layer w0.2: U29.21 92.21,12.03 U29.33 v1(91.74,11.56) 90.9,10.72 ; 90.16,10.43 90.21,10.48 ; 90.16,10.43 U29.8 ; 90.16,10.43 90.36,10.43 ; 90.36,10.43 90.55,10.62 90.55,10.67 90.61,10.72 90.9,10.72 ; 90.36,10.43 90.61,10.43 90.9,10.72 ; 90.36,10.43 90.35,10.42 90.35,10.33 ; U26.10 72.55,15.52 U26.21 ; 81.26,21.29 80.59,21.95 68.88,21.95 v1(67.79,20.86) ; v1(70.49,20.83) 71,21.35 78.92,21.35
  Top Layer w0.4: C142.1 112.19,27.91 v1(112.19,28.6) ; C122.1 C123.1 C124.1 C125.1 C126.1 C127.1 ; U30.7 116.49,35.53 v1(116.51,35.51) ; C140.1 v1(116.32,28.49) 116.87,29.04 v1(116.87,33.28) ; C121.1 99.62,15.92 v1(99.62,15.09) C120.1 ; C113.1 93.03,3.36 94.87,3.36 v1(95.23,3.71) 95.23,3.81 95.49,4.07 R145.1 ; 99.65,7.96 v1(99.65,8.74) 99.65,9.47 C116.1
  Top Layer w0.5: v1(76.99,13.16) 76.92,13.23 C95.1 C96.1 ; C102.1 65.51,18.59 v1(67.79,20.86) ; U30.7 113.95,35.53 113.21,36.27 113.21,42.59 C131.2 118.3,46.03 C132.1 120.02,45.75 C133.2 ; R146.1 v1(107.26,34.4) 107.87,34.4 C130.2 ; R141.1 83.65,15.09 83.24,15.5 83.24,17.53 83.68,17.97 R139.1 ; v1(77.19,10.93) 77.19,9.76 76.32,8.88 C94.1 73.81,8.88 C92.1 73.75,8.94 C93.1 72.16,8.56 71.66,8.06 69.18,8.06 v1(68.51,8.74) 68.64,8.88 R136.2 ; C108.1 84.26,12.15 v1(83.56,12.15) ; C101.1 75.1,20.24 C97.1 75.22,20.12 76.28,20.12 76.84,19.56 v1(76.84,17.89) ; C111.1 88.82,4.54 ; 88.82,4.54 88.83,4.54 v1(88.83,4.58) ; 88.82,4.54 C112.1 ; v1(83.56,10.52) 84.26,10.52 C109.1 ; 74.06,3.59 74.01,3.54 C136.1 71.73,4.24 U31.3 v1(69.28,4.24) U31.2 67.4,3.27 C134.2 65.02,4 C135.1 40.35,4 30.25,14.09 R170.1 ; C110.1 83.7,8.94 v1(83.54,8.79) 84.22,8.12 C107.1 84.15,5.68 v1(84.15,3.81) 85.63,3.81 86.75,4.94 86.75,6.92 v1(89.76,9.93) 90.15,10.32 ; v1(99.65,8.74) 100.15,8.24 100.15,5.23 v1(99.65,4.73) ; C100.1 70.51,20.81 v1(70.49,20.83) ; C121.1 100.46,16.83 100.46,18.75 99.51,19.7 C122.1
  Top Layer w0.6: 58.19,15.4 58.19,18.39 58.91,19.1 64.4,19.1 C102.1 65.52,17.99 C103.1 ; 58.19,15.4 58.8,16.01 61.55,16.01 62.71,14.84 C104.1 ; 58.19,15.4 58.19,13.36 58.8,12.75 61.95,12.75 62.2,13 65.26,13 C105.1 ; v1(99.62,15.09) 107.47,15.09 116.72,24.34 116.72,28.35 116.58,28.49 v1(116.32,28.49)
  Top Layer w0.8: v1(99.65,4.73) 99.65,4.12 101.61,2.15 R148.1 104.1,2.15 104.16,2.21 105.83,2.21 U32.3 U32.2 110.04,1.67 C137.2 112.29,2.3 C138.1
  Bottom Layer w0.4: v1(107.26,34.4) 108.24,33.43 116.71,33.43 v1(116.87,33.28) 116.87,35.16 v1(116.51,35.51) ; v1(116.32,28.49) 116.2,28.6 v1(112.19,28.6)
  Bottom Layer w0.5: v1(89.76,9.93) 90.91,11.08 90.91,11.18 91.29,11.56 v1(91.74,11.56) v1(92.55,11.56) ; v1(76.84,17.89) 76.84,13.31 v1(76.99,13.16) 77.19,12.96 v1(77.19,10.93) 77.19,10.21 78.82,8.59 83.34,8.59 v1(83.54,8.79) 83.54,10.5 v1(83.56,10.52) v1(83.56,12.15) 83.56,12.16 83.85,12.45 83.85,14.89 v1(83.47,15.27) ; v1(99.65,8.74) 99.62,8.77 v1(99.62,15.09) ; v1(69.28,4.24) 68.51,5.01 v1(68.51,8.74) ; v1(67.79,20.86) 67.82,20.83 v1(70.49,20.83) 73.74,20.83 v1(74.3,20.27) 72.15,18.13 v1(72.15,14.72) ; v1(84.15,3.81) 84.2,3.76 88.01,3.76 v1(88.83,4.58) 94.36,4.58 v1(95.23,3.71) 96.04,2.9 97.82,2.9 v1(99.65,4.73)
  vias: v1(71.53,14.72)
GND: length 441.7
  Top Layer w0.2: v1(94.36,51.72) 93.86,51.21 93.86,47.42 90.73,44.29 88.35,44.29 83.65,39.59 83.65,30.94 ; 86.29,20.22 86.76,20.69 86.76,27.81 88.57,29.62 92.66,29.62 94.9,31.86 102.01,31.86 104.39,34.24 v1(104.42,34.24) ; FPC5.30 68.24,31.39 68.27,31.41 68.27,31.39 ; 71.2,45.06 71.2,45.52 71.05,45.67 71.05,48.5 69.96,49.59 64.59,49.59 v1(64.04,50.14) 64.04,50.19 64.59,50.75 69.64,50.75 71.71,48.69 71.71,46.99 72.27,46.43 72.27,45.98 ; 104.39,60.77 104.4,60.76 108.24,60.76 108.86,61.39 108.86,62.44 109.93,63.5 112.8,63.5 113.97,62.34 113.97,60.3 113.67,60 112.86,60 112.6,60.25 112.6,62.49 112.3,62.79 111.69,62.79 111.38,62.49 111.38,60.1 v1(111.74,59.74) 111.89,59.74 112.25,59.39 116.04,59.39 116.04,59.38 116.11,59.39 116.86,58.63 116.86,56.49 117.42,55.93 118.4,55.93 R127.1 ; 118.83,56.98 117.81,56.98 117.47,57.32 117.47,58.96 116.21,60.22 114.79,60.22 114.66,60.34 114.66,62.64 113.18,64.11 109.68,64.11 108.23,62.66 108.23,61.62 108.08,61.47 108.08,61.46 108.03,61.42 104.83,61.42 104.83,61.42 ; R62.1 76.41,42.5 75.72,43.18 74.25,43.18 73.94,42.88 v1(73.94,42.62) ; FPC5.28 68.46,32.39 68.47,32.38 ; 94.57,54.56 94.57,55.63 v1(98.94,60) ; 74.3,40.8 72.27,40.8 69.27,37.8 v1(69.27,36.94) 70.06,36.94 73.21,40.08 74.35,40.08 ; 109.58,26.9 108.39,28.09 108.39,30.53 107.78,31.14 106.05,31.14 105.84,31.35 105.84,32.46 105.74,32.57 103.57,32.57 102.26,31.25 95.46,31.25 93.55,29.34 93.55,28.86 v1(93.09,28.4) ; 84.28,30.94 84.28,39.37 88.55,43.63 90.92,43.63 94.47,47.18 94.47,49.56 95.63,50.72 v1(95.63,51.72) ; 75.21,64.62 74.55,64.62 73.29,65.88 54.91,65.88 51.35,62.32 26.44,62.32 23.45,59.34 v1(21.06,59.34) 21.06,60.05 21.57,60.56 23.82,60.56 26.19,62.93 51.1,62.93 54.67,66.5 73.63,66.5 74.29,65.84 75.26,65.84 75.57,65.54 v1(76.23,65.54) ; FPC5.7 68.11,42.89 68.76,43.54 v1(68.76,44.35) ; 95.58,54.28 95.58,54.87 99.04,58.32 v1(99.19,58.32) ; v1(91.47,28.4) 90.85,29.02 88.82,29.02 87.36,27.56 87.36,20.68
  Top Layer w0.3: FPC6.2 124.73,63.5 v1(124.74,63.5) ; R65.2 76.59,38.2 75.82,38.97 74.09,38.97 v1(73.99,39.07) ; FPC6.15 124.9,57 v1(125.3,56.59)
  Top Layer w0.4: v1(65.81,62.18) 65.81,54.77 64.65,53.6 v1(64.65,52.17) ; v1(66.12,52.12) 66.12,53.44 66.98,54.3 v1(66.98,62.18) ; C41.2 99.74,38.31 98.05,38.31 ; v1(73.99,39.07) v1(72.98,38.05) v1(72.22,37.29) 70.18,35.26 68.76,35.26
  Top Layer w0.5: USB3.12 7.08,9.31 USB3.14 ; USB3.1 7.08,16.86 USB3.13
  Bottom Layer w0.2: 82.99,30.18 82.48,30.18 v1(79.58,27.28) 79.78,27.08 81.08,27.08 83.57,29.57 ; v1(66.98,62.18) 66.98,63.35 66.73,63.61 66.73,65.72 69.7,68.69 73.79,68.69 73.9,68.58 105.18,68.58 105.29,68.69 ; v1(98.94,60) 100.36,61.42 103.18,61.42
  vias: v1(1.08,41.32) v1(1.08,40.46) v1(1.08,39.74) v1(1.08,38.88) v1(1.09,42.88) v1(1.09,42.02) v1(1.2,7.27) v1(1.2,6.4) v1(1.3,31.4) v1(1.3,30.53) v1(1.3,20.22) v1(1.3,19.36) v1(1.81,13.87) v1(1.81,13.01) v1(1.91,42.88) v1(1.91,42.02) v1(1.89,41.32) v1(1.89,40.46) v1(1.89,39.74) v1(1.89,38.88) v1(2.06,20.22) v1(2.06,19.36) v1(2.01,7.27) v1(2.01,6.4) v1(2.11,31.4) v1(2.11,30.53) v1(2.62,13.87) v1(2.62,13.01) v1(2.87,20.22) v1(2.87,19.36) v1(2.87,7.27) v1(2.87,6.4) v1(2.98,31.4) v1(2.98,30.53) v1(3.43,13.87) v1(3.43,13.01) v1(3.69,7.27) v1(3.69,6.4) v1(3.79,31.4) v1(3.79,30.53) v1(3.74,20.22) v1(3.74,19.26) v1(4.25,13.87) v1(4.25,13.01) v1(5.82,63.73) v1(5.82,62.87) v1(5.82,61.82) v1(5.82,60.96) v1(5.82,59.95) v1(5.82,59.08) v1(5.87,58.07) v1(5.87,57.2) v1(5.82,56.14) v1(5.82,55.27) v1(5.82,54.21) v1(5.82,53.34) v1(5.87,52.02) v1(5.87,51.16) v1(6.63,63.73) v1(6.63,62.87) v1(6.63,61.82) v1(6.63,60.96) v1(6.63,59.95) v1(6.63,59.08) v1(6.68,58.07) v1(6.68,57.2) v1(6.63,56.14) v1(6.63,55.27) v1(6.63,54.21) v1(6.63,53.34) v1(6.68,52.02) v1(6.68,51.16) v1(7.9,48.31) v1(7.9,36.38) v1(7.9,35.51) v1(8.72,45.37) v1(8.72,44.5) v1(8.72,36.38) v1(8.72,35.51) v1(8.87,48.31) v1(9.43,35.51) v1(9.53,71.33) v1(9.53,45.37) v1(9.53,44.5) v1(9.78,48.31) v1(10.34,61.42) v1(10.39,62.69) v1(10.39,45.37) v1(10.39,44.5) v1(10.49,71.33) v1(10.65,48.31) v1(10.8,4.02) v1(10.85,1.73) v1(11,8.44) v1(11,7.57) v1(11.2,61.47) v1(11.2,45.37) v1(11.2,44.5) v1(11.41,71.38) v1(11.56,23.93) v1(11.56,23.02) v1(11.81,8.44) v1(11.81,7.57) v1(12.32,71.02) v1(13.08,1.68) v1(13.14,71.02) v1(13.11,4.07) v1(13.29,21.9) v1(13.29,21.03) v1(13.29,16.92) v1(13.29,16.01) v1(13.29,14.94) v1(14.1,21.9) v1(14.1,21.03) v1(15.12,20.48) v1(15.12,19.61) v1(15.22,54.21) v1(15.32,41.71) v1(15.32,40.85) v1(15.37,37.65) v1(15.37,36.78) v1(15.42,51.36) v1(15.42,50.5) v1(15.88,61.37) v1(15.93,20.48) v1(15.93,19.61) v1(16.08,54.21) v1(16.13,41.71) v1(16.13,40.85) v1(16.18,37.65) v1(16.18,36.78) v1(16.23,51.36) v1(16.23,50.5) v1(16.59,71.02) v1(16.69,62.08) v1(16.71,20.48) v1(16.71,19.61) v1(16.84,54.21) v1(16.95,41.71) v1(16.95,40.85) v1(17,37.65) v1(17,36.78) v1(17,35.97) v1(17.25,51.31) v1(17.25,50.45) v1(17.35,31.3) v1(17.35,30.48) v1(17.35,29.67) v1(17.35,28.91) v1(17.4,71.02) v1(17.4,62.39) v1(17.52,20.48) v1(17.52,19.61) v1(17.76,41.71) v1(17.76,40.85) v1(17.81,37.65) v1(17.81,36.78) v1(17.81,35.97) v1(18.06,51.31) v1(18.06,50.45) v1(18.22,31.3) v1(18.22,30.48) v1(18.22,29.67) v1(18.22,28.91) v1(18.37,12.7) v1(18.37,11.84) v1(18.37,10.98) v1(18.37,8.64) v1(18.37,7.67) v1(19.08,28.76) v1(19.18,12.7) v1(19.18,11.84) v1(19.18,10.98) v1(19.18,8.64) v1(19.18,7.67) v1(19.38,30.89) v1(19.89,28.76) v1(19.99,12.7) v1(19.99,11.84) v1(19.99,10.98) v1(19.99,8.64) v1(19.99,7.67) v1(20.25,23.57) v1(20.81,12.7) v1(20.81,11.84) v1(20.81,10.98) v1(20.81,8.64) v1(20.81,7.67) v1(21.06,58.89) v1(21.62,23.37) v1(21.77,61.73) v1(21.92,44.96) v1(22.03,65.13) v1(22.03,64.27) v1(22.48,40.64) v1(22.58,61.73) v1(22.74,44.96) v1(22.84,65.13) v1(22.84,64.27) v1(23.4,61.73) v1(23.55,44.96) v1(23.75,40.64) v1(23.8,18.55) v1(23.8,17.78) v1(23.8,16.92) v1(24.01,71.02) v1(24.62,18.55) v1(24.62,17.78) v1(24.62,16.92) v1(24.82,71.02) v1(25.17,40.64) v1(25.17,8.94) v1(25.99,35.06) v1(25.99,8.94) v1(26.5,59.19) v1(26.65,20.42) v1(26.8,35.06) v1(26.9,20.58) v1(27,11.28) v1(27.05,8.94) v1(27.16,20.42) v1(27.26,59.34) v1(27.97,59.44) v1(27.92,6.35) v1(27.92,5.49) v1(28.63,59.49) v1(28.78,71.23) v1(28.73,6.35) v1(29.14,18.09) v1(29.14,17.17) v1(29.14,16.26) v1(29.24,27.94) v1(29.44,59.69) v1(29.54,6.35) v1(29.7,71.23) v1(29.85,68.79) v1(30,12.04) v1(30,11.18) v1(30.15,27.94) v1(30.2,9.96) v1(30.36,59.74) v1(30.36,6.35) v1(30.36,5.49) v1(30.51,71.17) v1(30.76,68.79) v1(30.81,12.04) v1(30.81,11.18) v1(31.07,27.94) v1(31.58,68.74) v1(31.98,1.58) v1(32.74,52.99) v1(32.79,52.17) v1(32.79,31.3) v1(32.9,1.58) v1(33.66,30.89) v1(33.66,29.92) v1(33.86,52.99) v1(33.86,52.17) v1(33.81,1.58) v1(34.32,28.81) v1(34.78,59.54) v1(34.78,58.68) v1(34.73,52.99) v1(34.73,52.17) v1(35.13,28.81) v1(35.49,52.99) v1(35.59,59.54) v1(35.59,58.68) v1(35.89,25.4) v1(35.89,24.54) v1(35.89,23.78) v1(35.89,22.91) v1(35.89,22.05) v1(36,20.93) v1(36,20.17) v1(36,19.36) v1(36,18.55) v1(36,17.73) v1(36,16.82) v1(36,16.01) v1(36,15.19) v1(36,14.38) v1(36.71,25.4) v1(36.71,24.54) v1(36.71,23.78) v1(36.71,22.91) v1(36.71,22.05) v1(36.86,60.15) v1(36.86,20.93) v1(36.86,20.17) v1(36.86,19.36) v1(36.86,18.55) v1(36.86,17.73) v1(36.86,16.82) v1(36.86,16.01) v1(36.86,15.19) v1(36.86,14.38) v1(36.91,59.39) v1(36.91,58.53) v1(37.32,47.91) v1(37.72,60.15) v1(37.72,59.39) v1(37.72,58.53) v1(38.23,47.91) v1(38.48,60.15) v1(38.48,59.39) v1(39.14,47.91) v1(39.35,60.15) v1(39.35,59.39) v1(39.91,11.38) v1(40.01,28.81) v1(40.01,27.94) v1(40.11,60.15) v1(40.87,60.15) v1(40.88,40.55) v1(40.88,39.69) v1(40.82,28.81) v1(40.82,27.94) v1(41.13,32.62) v1(41.58,60.15) v1(41.58,6.1) v1(41.63,13.82) v1(41.63,13.16) v1(41.7,40.55) v1(41.7,39.69) v1(42.14,32.62) v1(42.24,6.1) v1(42.34,60.15) v1(42.29,13.82) v1(42.29,13.16) v1(42.51,40.55) v1(42.51,39.69) v1(43.32,40.55) v1(43.32,39.69) v1(43.56,34.55) v1(43.56,33.68) v1(43.56,13.16) v1(44.38,34.55) v1(44.38,33.68) v1(44.48,13.16) v1(45.6,11.08) v1(46.05,43.03) v1(46.16,13.62) v1(46.26,41.96) v1(46.97,13.62) v1(47.07,21.85) v1(47.07,20.98) v1(47.79,39.54) v1(47.88,21.85) v1(47.88,20.98) v1(48.35,39.03) v1(49.22,38.98) v1(49.41,49.27) v1(49.71,45.93) v1(50.02,45.16) v1(50.32,49.27) v1(50.68,44.66) v1(51.24,49.27) v1(54.54,13.31) v1(54.79,6.51) v1(55.05,44.2) v1(55.2,14.08) v1(55.2,13.31) v1(55.4,43.54) v1(55.45,15.24) v1(55.45,6.51) v1(55.86,42.68) v1(55.96,44.2) v1(56.47,6.96) v1(56.62,43.64) v1(57.13,6.96) v1(57.84,47.25) v1(57.94,36.33) v1(58.65,47.25) v1(58.65,46.23) v1(58.75,36.33) v1(59.16,39.02) v1(59.11,17.33) v1(59.21,38.05) v1(59.21,37.09) v1(59.23,14.33) v1(59.46,47.25) v1(59.46,46.23) v1(59.67,69.75) v1(59.82,61.12) v1(60.07,5.24) v1(60.33,69.75) v1(60.58,10.72) v1(61.5,10.62) v1(61.61,31.16) v1(61.61,30.34) v1(61.61,29.63) v1(61.61,28.82) v1(61.61,28.01) v1(61.61,27.19) v1(63.58,69.8) v1(63.69,31.16) v1(63.69,30.34) v1(63.69,29.63) v1(63.69,28.82) v1(63.69,28.01) v1(63.69,27.19) v1(63.72,17.41) v1(64.09,41.61) v1(64.09,40.75) v1(64.09,39.93) v1(64.09,39.12) v1(64.49,69.8) v1(65,8.64) v1(65.41,69.8) v1(65.76,47.09) v1(66.37,8.44) v1(66.47,47.65) v1(67.54,8.64) v1(67.69,25.25) v1(67.8,47.15) v1(68.35,12.2) v1(68.41,24.59) v1(68.81,45.22) v1(69.12,23.88) v1(69.32,44.71) v1(70.03,12.04) v1(70.64,60.66) v1(70.74,38.41) v1(72.28,30.39) v1(72.38,32.12) v1(72.57,34.95) v1(73.13,41.91) v1(73.09,29.63) v1(73.19,31.31) v1(73.38,34.95) v1(73.33,13.11) v1(73.84,38.2) v1(73.99,42.02) v1(74.01,29.58) v1(73.99,13.11) v1(74.16,31.11) v1(74.3,26.17) v1(74.4,57.86) v1(74.4,57.05) v1(74.4,56.24) v1(75.01,26.11) v1(75.77,4.02) v1(76.18,3.1) v1(76.74,64.72) v1(76.94,62.79) v1(76.99,3.1) v1(77.14,65.33) v1(77.35,8.33) v1(77.6,62.74) v1(77.8,30.99) v1(77.8,29.47) v1(77.8,3.1) v1(77.91,35.36) v1(77.91,34.55) v1(77.96,31.8) v1(78.21,19.82) v1(78.56,71.33) v1(78.56,14.89) v1(78.87,19.51) v1(78.82,17.02) v1(78.97,34.24) v1(78.97,11.23) v1(79.48,71.33) v1(79.58,5.69) v1(79.63,6.4) v1(80.39,71.33) v1(80.39,5.69) v1(82.07,53.09) v1(82.88,53.09) v1(84.61,71.17) v1(84.71,51.72) v1(85.27,71.17) v1(85.93,47.04) v1(86.08,71.17) v1(86.49,47.04) v1(86.74,71.17) v1(86.95,13.57) v1(88.27,16.26) v1(88.37,39.02) v1(88.72,55.83) v1(89.18,39.02) v1(90,39.02) v1(90,22.3) v1(90.3,32.11) v1(91.11,32.11) v1(91.93,32.11) v1(92.28,28.4) v1(94.21,44.66) v1(94.31,9.05) v1(94.72,45.22) v1(94.76,15.52) v1(95.02,37.88) v1(95.02,37.07) v1(95.02,36.25) v1(95.84,9.5) v1(96.14,47.96) v1(96.14,47.09) v1(96.24,14.99) v1(96.45,71.23) v1(96.8,47.09) v1(97.11,71.23) v1(98.22,28.25) v1(99.04,28.25) v1(99.34,22.97) v1(99.5,43.59) v1(99.85,28.25) v1(100.16,22.97) v1(100.61,43.69) v1(100.82,51.87) v1(100.97,22.97) v1(101.32,38.76) v1(101.32,6.51) v1(101.32,4.32) v1(101.48,51.21) v1(101.48,43.54) v1(101.78,46.69) v1(101.78,39.27) v1(101.73,11.43) v1(102.09,50.35) v1(102.14,9.3) v1(102.19,6.35) v1(102.24,39.78) v1(102.44,71.17) v1(102.44,56.49) v1(102.74,46.69) v1(102.9,6.35) v1(103.1,71.17) v1(103.15,57.1) v1(103.15,56.24) v1(103.56,47.45) v1(105.13,35.61) v1(105.13,34.8) v1(105.54,62.84) v1(105.54,19.76) v1(106.15,62.94) v1(106.2,27.54) v1(106.35,19.76) v1(106.4,13.06) v1(106.91,57.15) v1(106.96,27.54) v1(107.01,63.96) v1(107.17,19.76) v1(107.22,13.06) v1(107.47,55.12) v1(107.47,54.31) v1(107.47,53.5) v1(107.57,41.25) v1(107.67,27.54) v1(108.08,55.83) v1(108.03,13.06) v1(108.39,41.25) v1(108.64,25.05) v1(109.05,52.48) v1(109.2,41.25) v1(109.45,25.05) v1(110.21,38.51) v1(110.26,25.05) v1(110.47,66.55) v1(110.47,47.6) v1(111.28,47.6) v1(111.48,66.5) v1(111.43,51.77) v1(111.69,32.72) v1(111.69,31.91) v1(111.69,31.09) v1(111.79,46.59) v1(112.09,47.6) v1(112.14,21.54) v1(112.45,46.59) v1(112.7,66.55) v1(112.86,52.43) v1(113.11,52.99) v1(113.41,52.23) v1(113.57,22.97) v1(114.48,32.06) v1(114.94,47.7) v1(115.09,63.15) v1(115.14,24.69) v1(115.55,56.19) v1(115.7,62.84) v1(115.7,54.77) v1(115.85,63.55) v1(116,32.26) v1(116.61,40.85) v1(117.17,54.66) v1(117.48,55.27) v1(117.43,40.85) v1(117.78,54.77) v1(117.94,12.45) v1(118.21,62.12) v1(118.24,40.85) v1(118.29,29.92) v1(118.65,66.14) v1(118.9,61.98) v1(119,13.47) v1(119.61,26.52) v1(119.71,66.35) v1(119.87,30.13) v1(120.07,65.69) v1(120.32,14.48) v1(120.42,26.52) v1(120.68,65.69) v1(121.24,26.52) v1(121.44,66.35) v1(121.75,64.93) v1(122.15,63.76) v1(122.71,64.98) v1(123.62,37.85) v1(124.13,66.5) v1(124.13,3.31) v1(124.28,37.85) v1(124.49,31.65) v1(124.69,65.84) v1(125.15,31.65) v1(125.25,63.2) v1(125.4,55.38) v1(125.5,4.32) v1(125.81,54.61) v1(125.96,56.59) v1(126.27,5.44) v1(126.67,55.43) v1(126.83,63.91) v1(127.28,52.73) v1(127.33,58.42) v1(127.38,57.66) v1(127.94,52.73) v1(129.77,35.87) v1(129.77,35.21) v1(129.77,21.49) v1(129.77,20.83) v1(129.87,42.78) v1(129.87,42.12) v1(129.82,28.71) v1(129.82,28.05) v1(129.92,14.68) v1(129.92,14.02)
VCC5: length 310.6
  Top Layer w0.3: U8.3 27.88,20.03 27.56,19.71 26.24,19.71 25.98,19.98 U8.1
  Top Layer w0.5: v1(6.86,46.87) 14.97,46.87 C36.1 18.08,45.45 C37.1 19.04,45.48 19.82,44.71 U12.16 ; CN6.4 4.25,25.47 H5.4 ; U30.6 113.75,34.88 112.09,36.54 112.09,43.13 116.39,47.43 C131.1 118.27,47.43 C132.2 123.36,47.75 C133.1 123.75,47.68 v1(124.79,46.64) ; v1(9.33,31.55) 7.72,33.15 4.83,33.15 3.56,34.42 v1(3.56,48.14)
  Top Layer w0.6: v1(127.69,45.88) 127.69,14.13 114.26,0.7 62.32,0.7 60.07,2.95 34.65,2.95 F1.2
  Top Layer w0.8: C13.2 16.24,21.48 11.18,26.55 v1(11.18,29.21) ; C13.2 25.82,21.48 U8.1 ; C13.2 23.24,20.32 21.85,18.93 19.31,18.93 18.42,18.04 18.42,14.99 19.05,14.35 23.97,14.35 24.77,13.55 24.77,10.8 25.01,10.56 ; 22.47,9.66 22.28,9.86 D2.2 16.51,7.37 H3.6 H3.4 9.4,5.34 ; 22.47,9.66 22.61,9.8 ; 22.47,9.66 22.48,9.66 ; 29.97,7.76 24.38,7.76 22.48,9.66 ; 29.97,7.76 27.88,9.85 U7.3 ; 29.97,7.76 30.97,7.76 33.91,4.82 F1.2 ; 22.61,9.8 22.61,9.78 22.48,9.66 ; 22.61,9.8 C10.2 25.01,10.56 ; 25.01,10.56 25.82,10.56 U7.1
  Bottom Layer w0.5: v1(6.86,46.87) 5.59,48.14 v1(3.56,48.14)
  Bottom Layer w0.8: 9.4,5.34 9.4,20.32 H5.4 ; v1(127.69,45.88) 126.93,46.64 v1(124.79,46.64) ; v1(9.33,31.55) 11.18,29.7 v1(11.18,29.21)
VCC_1.5: length 141.4
  Top Layer w0.2: FPC6.10 123.02,59.5 122.61,59.08 122.61,56.72 121.04,55.15 121.04,53.57 C89.1
  Top Layer w0.3: FPC6.10 124.95,59.5 125.5,60.05 v1(126.37,60.05)
  Top Layer w0.4: v1(90,2.49) 80.85,2.49 77.53,5.81 61.73,5.81 58.24,9.3 55.91,9.3 55.55,9.66
  Top Layer w0.5: 55.55,9.67 55.55,9.66 55.35,9.86 55,9.86 ; 55,9.86 55.05,9.9 ; 55,9.86 53.27,9.86 ; C86.2 52.85,9.95 R121.2 51.13,9.94 U25.5 ; v1(129.62,60.05) 129.62,56.09 130.99,54.72 130.99,51.67 126.42,47.09 126.42,26.32 v1(107.57,7.47)
  Bottom Layer w0.5: v1(90,2.49) 94.82,2.49 95.08,2.24 102.32,2.24 107.56,7.47 v1(107.57,7.47) ; v1(129.62,60.05) v1(126.37,60.05)
VCC_2.8: length 153.5
  Top Layer w0.3: FPC6.11 125.11,59 125.5,59.39 126.72,59.39 127.03,59.69 127.03,61.22 125.75,62.5 FPC6.4 121.48,62.5 121.27,62.72 120.24,62.72
  Top Layer w0.4: v1(57.38,11.13) 58.91,11.13 63.12,6.92 77.6,6.92 v1(78.21,7.52) ; v1(106.5,8.49) 125.87,27.85 125.87,47.32 130.44,51.9 130.44,54.49 128.91,56.02 v1(128.91,61.17) ; v1(120.93,61.12) 120.91,61.14 C90.1
  Top Layer w0.5: C90.1 120.24,62.72 C88.1 ; U24.5 51.04,18.63 51.55,18.12 C81.2 ; C82.2 53.96,18.37 53.57,17.99
  Top Layer w0.6: v1(57.38,13.06) 57.28,13.16 57.28,17.33 56.24,18.37 C82.2
  Bottom Layer w0.4: v1(128.91,61.17) 126.62,61.17 125.91,61.88 122.1,61.88 121.34,61.12 v1(120.93,61.12)
  Bottom Layer w0.5: v1(57.38,13.06) v1(57.38,11.13) ; v1(78.21,7.52) 78.37,7.68 105.7,7.68 v1(106.5,8.49)
VCC_3.3: length 578
  Top Layer w0.2: 46.35,36.45 R13.1 ; R98.2 77.89,63.76 74.29,63.76 72.88,65.18 72.16,65.18 ; 20.06,56.63 R7.1 ; v1(107.12,56.19) 107,56.08 106.26,56.08 ; R100.2 106.58,65.25 107.98,66.65 107.98,67.72 109.81,69.55 H7.1 ; 18.58,60.99 R9.1 ; FPC5.36 FPC5.37 ; R61.1 76.9,41.14 ; R108.2 77.52,57.99 76.89,57.36 76.89,55.93 v1(77.32,55.51) 77.7,55.12 R109.2
  Top Layer w0.3: 65.27,42.61 v1(65.31,42.57) 65.31,43.03 65.66,43.39 FPC5.6 67.79,43.39 68.15,43.74 68.15,45.72 R64.1 ; 65.22,30.36 65.22,28.82 65.65,28.39 FPC5.36 ; 65.22,30.36 65.24,30.39 FPC5.32 ; 65.22,30.36 v1(65.22,32.99) 65.62,33.39 FPC5.26 73.23,33.39 74.04,32.57 75.66,32.57 75.97,32.88 75.97,34.24 R67.2 ; 71.61,65.18 71.41,64.98 71.41,61.36 72.37,60.4 73.38,60.4 75.37,58.42 v1(75.37,56.04) ; v1(95.94,44.86) 96.96,45.88 99.65,45.88 100.32,46.55 R99.2 103.14,48.2 105.13,50.19 v1(114.07,50.19)
  Top Layer w0.4: v1(117.73,53.45) 118.39,54.11 R124.2 ; C41.1 100.12,40.26 98.05,40.26 ; R66.2 76.94,36.63 77.6,37.29 77.6,40.44 76.9,41.14 76.9,41.39 82.21,46.7 84.11,46.7 v1(84.51,47.09) R97.2 ; R125.2 118.65,58.37 v1(118.14,57.86) ; C4.2 20.06,58.06 R8.1 24.49,58.04 ; 72.16,65.18 55.2,65.18 51.64,61.62 26.73,61.62 24.49,59.38 24.49,58.04 ; 24.49,58.04 R3.1
  Top Layer w0.5: v1(115.8,65.69) 109.1,65.69 108.39,64.98 106.42,64.98 R100.2 ; U7.5 25.98,15.57 C11.2 ; 19.97,16.01 25.55,16.01 C11.2 ; R125.2 R123.2 117.88,59.8 117.38,60.3 v1(117.38,61.34) 117.38,63.5 118.04,64.16 R122.2 ; C79.2 43.2,18.22 C78.2 41.33,19.21 v1(41.13,19.41) ; v1(11.41,60.4) 9.66,58.65 ; U18.10 U18.9 47.99,37.1 46.93,38.17 C70.2 ; R64.1 68.04,49.08 53.93,49.08 v1(51.08,46.23) 50.42,46.89 47.02,46.89 44.73,44.61 44.73,38.92 45.48,38.17 C70.2 ; R118.2 48.09,7.16 48.09,9.3 47.44,9.94 U25.1 44.16,9.94 43.97,9.76 ; C70.2 46.35,36.45 ; U18.1 52.79,41.2 C69.2 54.29,42.82 v1(53.06,44.05) ; C84.2 43.95,9.83 C83.2 ; 43.51,18.24 43.9,18.63 U24.1 47.03,18.63 47.68,17.98 47.68,16.06 48.38,15.35 R115.2 ; C11.2 25.97,15.67 C12.2 ; R67.2 v1(76.72,35.87) R66.2
  Top Layer w0.6: C12.2 25.97,18.58 26.29,18.9 28.02,18.9 28.98,19.87 28.98,22 28.53,22.46 25.28,22.46 24.67,23.07 24.67,24.34 22.89,26.11 17.05,26.11 v1(12.63,30.53) 13.69,31.6 15.27,31.6 16.23,32.57 35.44,32.57 40.16,37.29 43.26,37.29 ; 43.26,37.29 46.29,37.29 46.35,37.24 ; 43.26,37.29 38.43,32.46 38.43,30.87 ; R8.1 20.06,55.2 R77.1 ; C41.1 100.21,40.59 v1(95.94,44.86) ; 18.58,59.54 18.4,59.72 17.39,58.71 CARD1.4 ; 18.58,59.54 v1(18.58,61.6) R78.1 ; 18.58,59.54 C4.2 ; v1(10.24,32.87) 9.09,34.02 5.28,34.02 4.45,34.85 4.45,47.37 9.22,52.15 9.22,58.22 9.66,58.65 9.27,59.03 9.27,66.75 12.42,69.9 32.19,69.9 H2.2 H2.4 H2.6 40.97,70.77 41.53,71.33 74.58,71.33 75.21,70.69 R1.2 75.92,69.84 77.66,68.11 C73.1 ; 38.43,30.87 43.54,30.87 H8.1 ; 38.43,30.87 v1(38.43,19.46) 38.43,11.13 39.65,9.91 41.89,9.91 C83.2 ; v1(108.84,60.45) 109.43,61.03 109.43,61.39
  Top Layer w0.8: 83.18,69.81 82.33,69.81 80.86,68.34 C74.1 79.4,68.11 C73.1
  Bottom Layer w0.2: v1(108.84,60.45) 108.84,57.92 v1(107.12,56.19) ; v1(77.32,55.51) 76.79,56.04 v1(75.37,56.04)
  Bottom Layer w0.4: v1(108.84,60.45) 109.82,61.42 117.29,61.42 v1(117.38,61.34) ; v1(84.51,47.09) 84.51,43.89 86.99,41.41 92.49,41.41 v1(95.94,44.86) ; v1(114.07,50.19) 114.48,50.19 v1(117.73,53.45) 118.29,53.45 119.56,54.72 119.56,57.25 118.95,57.86 v1(118.14,57.86) ; v1(65.31,42.57) 65.31,33.07 v1(65.22,32.99)
  Bottom Layer w0.5: v1(51.08,46.23) 53.06,44.25 v1(53.06,44.05) ; v1(41.13,19.41) 41.08,19.46 v1(38.43,19.46)
  Bottom Layer w0.6: v1(12.63,30.53) 10.29,32.87 v1(10.24,32.87) ; v1(18.58,61.6) 17.48,61.6 16.28,60.4 v1(11.41,60.4) ; v1(115.8,65.69) 117.38,64.11 v1(117.38,61.34)
VCC_3.3A: length 212.5
  Top Layer w0.2: 84.97,15.76 84.97,14.39 R140.1 ; 84.97,15.76 85.01,15.8 86.24,15.8 v1(87.71,14.33) ; 84.97,15.76 R138.1 ; 85.62,7.34 C106.1 ; C106.1 85.64,7.64 89.13,11.13 89.9,11.13 ; C106.1 85.83,7.37 89.29,10.83 U29.7 U29.6 89.9,11.13 ; C106.1 89.3,11.03 89.8,11.03 89.9,11.13 ; v1(75.26,12.25) 75.21,12.2 74.81,12.2 ; v1(75.26,12.25) 74.86,12.25 74.81,12.2 ; v1(75.26,12.25) 75.21,12.3 ; 74.81,12.2 74.42,12.2 ; 74.81,12.2 74.45,11.84 72.32,11.84 71.76,12.4 71.76,13.2 U26.3 U26.4 72.15,12.47 72.42,12.2 74.42,12.2 ; 96.72,12.83 U29.23 U29.22 96.58,12.43 98.22,14.07 C120.2 ; 74.52,12.3 75.21,12.3 ; 74.52,12.3 74.67,12.45 75.06,12.45 75.21,12.3 ; 74.52,12.3 74.42,12.2 ; R134.2 71.39,9.6 74.73,9.6 C94.2 ; C97.2 72.55,16.28 U26.11 ; R144.1 93.35,5.19 90.66,5.19 90.61,5.24 89.08,5.24 88.93,5.39 88.93,7.06 v1(90.25,8.39)
  Top Layer w0.3: 94.01,12.83 94,12.82 94,12.65 v1(95.94,12.65) 96.54,12.65 C120.2
  Top Layer w0.4: v1(59.36,6.51) 60.33,6.51 61.52,5.31 76.82,5.31 v1(77.24,4.88) ; v1(76.13,10.27) 76.11,10.28 C94.2 75.41,10.91 75.42,10.93 ; v1(76.28,7.88) 75.88,7.48 64.28,7.48 v1(62.31,9.45)
  Top Layer w0.5: 72.72,16.11 73.03,16.41 73.13,16.41 75.1,18.38 C97.2 75.97,17.96 v1(75.97,17.12) ; v1(85.63,5.19) 85.63,5.73 C107.2 85.62,7.34 ; v1(63.92,10.94) 65.43,10.94 65.53,11.05 ; U8.5 25.98,26.6 C14.2 26.1,26.72 C15.2 26.1,29.53 26.42,29.85 30.79,29.85 32.13,28.5 32.13,13.06 40.6,4.6 57.45,4.6 v1(59.36,6.51)
  Top Layer w0.6: R137.1 65.53,10.35 R135.2
  Bottom Layer w0.2: v1(87.71,14.33) 88.42,13.62 v1(88.42,10.21) v1(90.25,8.39)
  Bottom Layer w0.4: v1(76.28,7.88) 76.28,10.11 v1(76.13,10.27) ; v1(75.26,12.25) 75.41,12.1 v1(75.41,10.97)
  Bottom Layer w0.5: v1(95.94,12.65) 90.86,12.65 v1(88.42,10.21) ; v1(59.36,6.51) v1(62.31,9.45) 63.8,10.94 v1(63.92,10.94) ; v1(77.24,4.88) 81.97,4.88 82.47,5.38 85.43,5.38 v1(85.63,5.19) ; v1(75.26,12.25) 75.97,12.96 v1(75.97,17.12)
ADC_MIC1N: length 25.6
  Top Layer w0.2: C114.2 97.02,2.51 96.02,1.5 74.64,1.5 R147.2
ADC_MIC1P: length 31.8
  Top Layer w0.2: C115.2 98.61,2.06 97.75,1.2 73.37,1.2 C136.2
  Top Layer w0.5: C136.2 72.08,1.78 U31.4
ADC_MIC2N: length 18
  Top Layer w0.2: C118.1 99.65,12.73 107.22,5.16 107.22,3.25 106.91,2.95 102.78,2.95 102.59,3.15 R148.2
ADC_MIC2P: length 11.9
  Top Layer w0.2: C119.1 99.59,10.87 104.16,6.3 C139.2 105.84,3.61 106,3.76 106,3.76 U32.4
ADC_MIC3N: length 3.7
  Top Layer w0.2: 88.45,23.02 88.45,20.68 C129.1
ADC_MIC3P: length 5.4
  Top Layer w0.2: C144.2 92.42,23.05 C128.1
ADC_MICBIAS12: length 83.1
  Top Layer w0.25: C138.2 111.69,3.7 110.67,3.7 110.24,4.13 U32.1 ; C121.2 98.94,15.2 98.94,13.72 99.14,13.52 100.47,13.52 106.52,7.47 v1(106.56,7.47)
  Top Layer w0.3: C121.2 95.59,13.36 93.91,13.36 ; C135.2 63.86,1.92 v1(62.54,1.92) ; v1(96.4,3.61) 94.67,1.88 75.82,1.88 74.96,2.75 74.96,2.8 ; C138.2 111.16,5.64 108.39,5.64 v1(106.56,7.47)
  Top Layer w0.5: C135.2 65.62,2 C134.1 68.3,1.87 U31.1
  Bottom Layer w0.3: v1(75.01,2.75) 64.9,2.75 64.07,1.92 v1(62.54,1.92)
  Bottom Layer w0.5: v1(106.56,7.47) 104.58,5.49 98.28,5.49 v1(96.4,3.61)
ADC_MICBIAS34: length 6.7
  Top Layer w0.2: U29.26 93,15 95.08,17.07 95.94,17.07 97.11,18.24 C123.2
BAT_MEAS_ADC: length 76
  Top Layer w0.2: C75.2 79.94,62.74 80.65,63.46 ; 80.65,63.46 v1(73.73,63.46) 72.87,64.32 72.59,64.32 RN10.4 ; 80.65,63.46 81.92,64.73 U21.6 ; CARD1.8 16.3,63.11 16.79,63.61 19.38,63.61 20.09,62.9 R78.2 20.34,62.64 v1(24.46,62.64) ; v1(26.9,60.71) 27.41,61.22 51.8,61.22 55.36,64.78 68.5,64.78 v1(68.96,64.32)
  Bottom Layer w0.2: v1(73.73,63.46) 72.87,64.32 v1(68.96,64.32) ; 24.46,62.59 v1(24.46,62.64) 26.39,60.71 v1(26.9,60.71)
BOOT: length 178.6
  Top Layer w0.2: v1(70.49,68.13) 42.7,68.13 40.87,66.3 28.12,66.3 26.75,67.67 v1(22.43,67.67) ; R106.2 104.76,53.26 R107.2 ; v1(106.96,62.69) 106.98,62.69 109.31,65.02 116.02,65.02 119.31,68.31 H7.4 117.93,70.92 110.57,70.92 108.79,69.14 v1(108.08,69.14) ; R105.2 104.76,57.47 v1(104.76,56.81) R107.2 ; U21.27 101.84,54.57 102.14,54.87 104.59,54.87 R107.2
  Top Layer w0.254: v1(22.43,67.67) 22.23,67.47 12.53,67.47 11.87,66.81 11.87,66.8 10.95,65.88 10.95,63.92 12.78,62.09 12.78,59.53 11.61,58.36 11.61,54.22 13.6,52.23 21.36,52.23 D4.2 ; BOOT5.2 14.69,68.89 v1(18.32,68.89) 19.35,68.89 BOOT5.1
  Bottom Layer w0.2: v1(104.76,56.81) 106.96,59.01 v1(106.96,62.69) ; v1(108.08,69.14) 106.2,69.14 105.29,68.23 70.59,68.23 v1(70.49,68.13) ; v1(18.32,68.89) 21.21,68.89 v1(22.43,67.67)
BT_ARRAY_ADC: length 114.7
  Top Layer w0.2: v1(98.68,70.62) 98.68,69.85 97.51,68.69 85.81,68.69 84.46,67.33 84.46,66.48 83.97,66 U21.5 80.13,66 C76.2 79.82,65.59 R98.1 ; v1(129.52,62.23) 133.99,57.76 133.99,47.07 KEY0.4 KEY0.3 KEY1.4 KEY1.3 KEY5.4 KEY5.3 KEY4.3 KEY3.4 KEY3.3 133.8,11.92 KEY2.4 KEY2.3 ; v1(127.06,62.25) 121.85,67.47 v1(119.46,67.47)
  Bottom Layer w0.2: v1(127.06,62.25) 129.5,62.25 v1(129.52,62.23) ; v1(98.68,70.62) 98.84,70.46 108.44,70.46 111.43,67.47 v1(119.46,67.47)
CAMERA_D2: length 89.9
  Top Layer w0.2: FPC5.33 71.24,29.89 73.08,28.05 v1(77.96,28.05) ; v1(92.51,54.77) U21.21 92.51,52.15 93.08,51.58 93.08,47.49 90.48,44.9 88.11,44.9 83.04,39.83 83.04,31.96 v1(82.68,31.6) ; v1(103.31,53.8) 103.31,53.4 104.78,51.92 107.02,51.92 U23.1 109.43,55.51 109.96,56.04 113.67,56.04 114.12,55.58 114.12,52.94 116.37,50.69 121.03,50.69 122.25,51.91 122.25,54.31 122.91,54.97 123.71,54.97 FPC6.19
  Bottom Layer w0.2: v1(103.31,53.8) 103.31,54.08 102.12,55.27 93.02,55.27 v1(92.51,54.77) ; v1(77.96,28.05) 78.9,28.05 82.45,31.6 v1(82.68,31.6)
CAMERA_D3: length 86
  Top Layer w0.2: R57.1 71.61,28.81 72.93,27.49 78.06,27.49 ; v1(84.31,29.57) 84.66,29.92 84.66,39.32 88.67,43.33 91.05,43.33 94.77,47.06 94.77,49.44 96.32,50.98 U21.24 v1(96.32,54.72) ; FPC6.21 122.89,54 122.55,53.67 122.55,51.79 121.16,50.39 116.22,50.39 113.81,52.8 113.81,55.44 113.52,55.73 110.93,55.73 110.67,55.48 110.7,55.45 U23.2 110.67,54.31 110.67,52.84 109.46,51.62 104.64,51.62 102.44,53.82 v1(102.44,54.11) ; 78.06,27.49 78.44,27.49 79.35,26.57 81.41,26.57 v1(81.92,27.08) ; 78.06,27.49 78.06,27.49
  Bottom Layer w0.2: v1(81.92,27.08) 84.31,29.47 v1(84.31,29.57) ; v1(102.44,54.11) 102.09,54.46 96.58,54.46 v1(96.32,54.72)
CAMERA_D4: length 82.3
  Top Layer w0.2: v1(93.81,54.66) 93.81,53.31 U21.22 93.78,52.05 93.46,51.73 93.46,47.45 90.61,44.6 88.23,44.6 83.34,39.71 83.34,31.3 v1(82.88,30.84) ; v1(78.26,26.88) 78.06,27.08 70.78,27.08 R60.1 ; v1(102.19,53.24) 102.59,53.24 104.52,51.32 109.81,51.32 111.97,53.47 U23.3 111.99,54.31 111.99,52.38 112.8,51.57 114.4,51.57 115.87,50.09 121.28,50.09 122.86,51.66 122.86,53.3 123.06,53.5 FPC6.22
  Bottom Layer w0.2: v1(93.81,54.66) 94.31,54.16 101.27,54.16 v1(102.19,53.24) ; v1(78.26,26.88) 82.22,30.84 v1(82.88,30.84)
CAMERA_D5: length 127.7
  Top Layer w0.2: v1(77.91,51.01) 77.91,51.29 73.59,55.61 73.59,58.07 v1(73.33,58.32) 73.03,58.63 72.4,58.63 RN11.3 ; v1(64.24,58.32) 59.72,53.8 19.64,53.8 18.53,54.91 R77.2 18.29,55.41 CARD1.1 ; v1(89.94,55.68) 88.72,54.46 85.68,54.46 84.89,53.67 U21.15 82.61,51.01 v1(82.12,51.01) ; v1(101.12,53.45) 103.56,51.01 114.53,51.01 115.79,49.74 122.11,49.74 125,52.63 125,54.21 124.71,54.5 FPC6.20
  Bottom Layer w0.2: v1(82.12,51.01) v1(77.91,51.01) ; 64.24,58.32 v1(73.33,58.32) ; v1(89.94,55.68) 91.77,53.86 100.71,53.86 v1(101.12,53.45)
